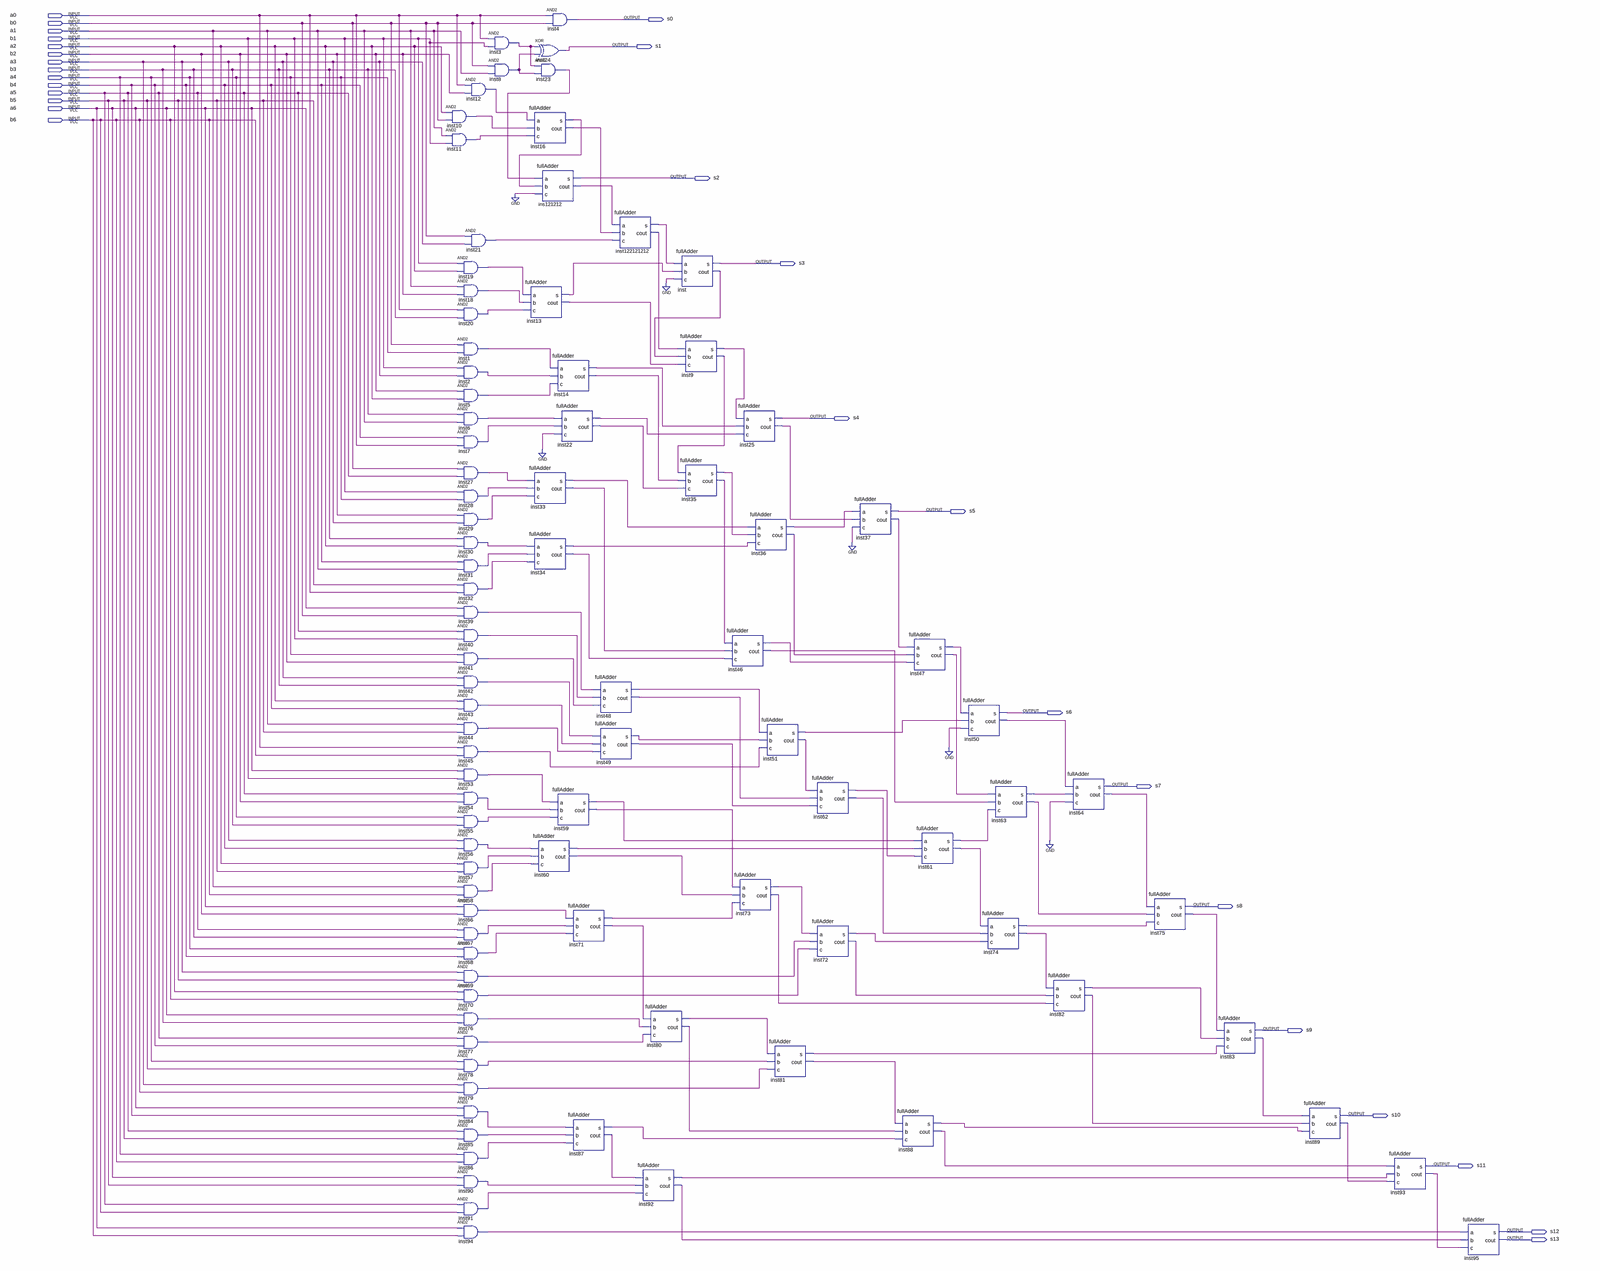
[diagram p0: schematic sheet, whole]
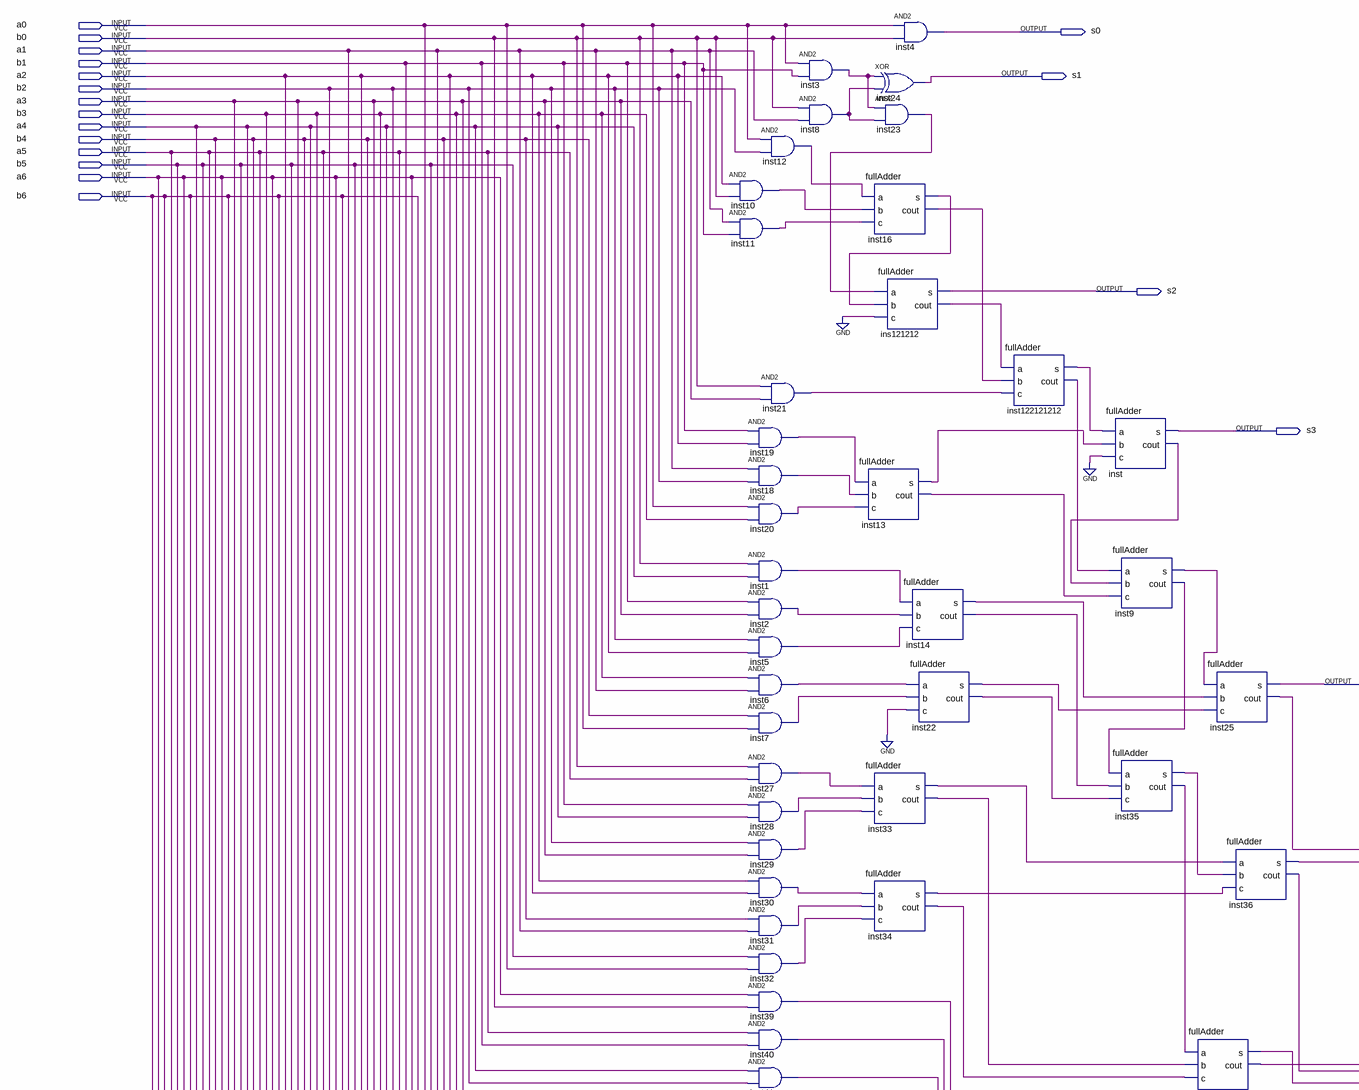
[diagram p1: schematic sheet, upper left part]
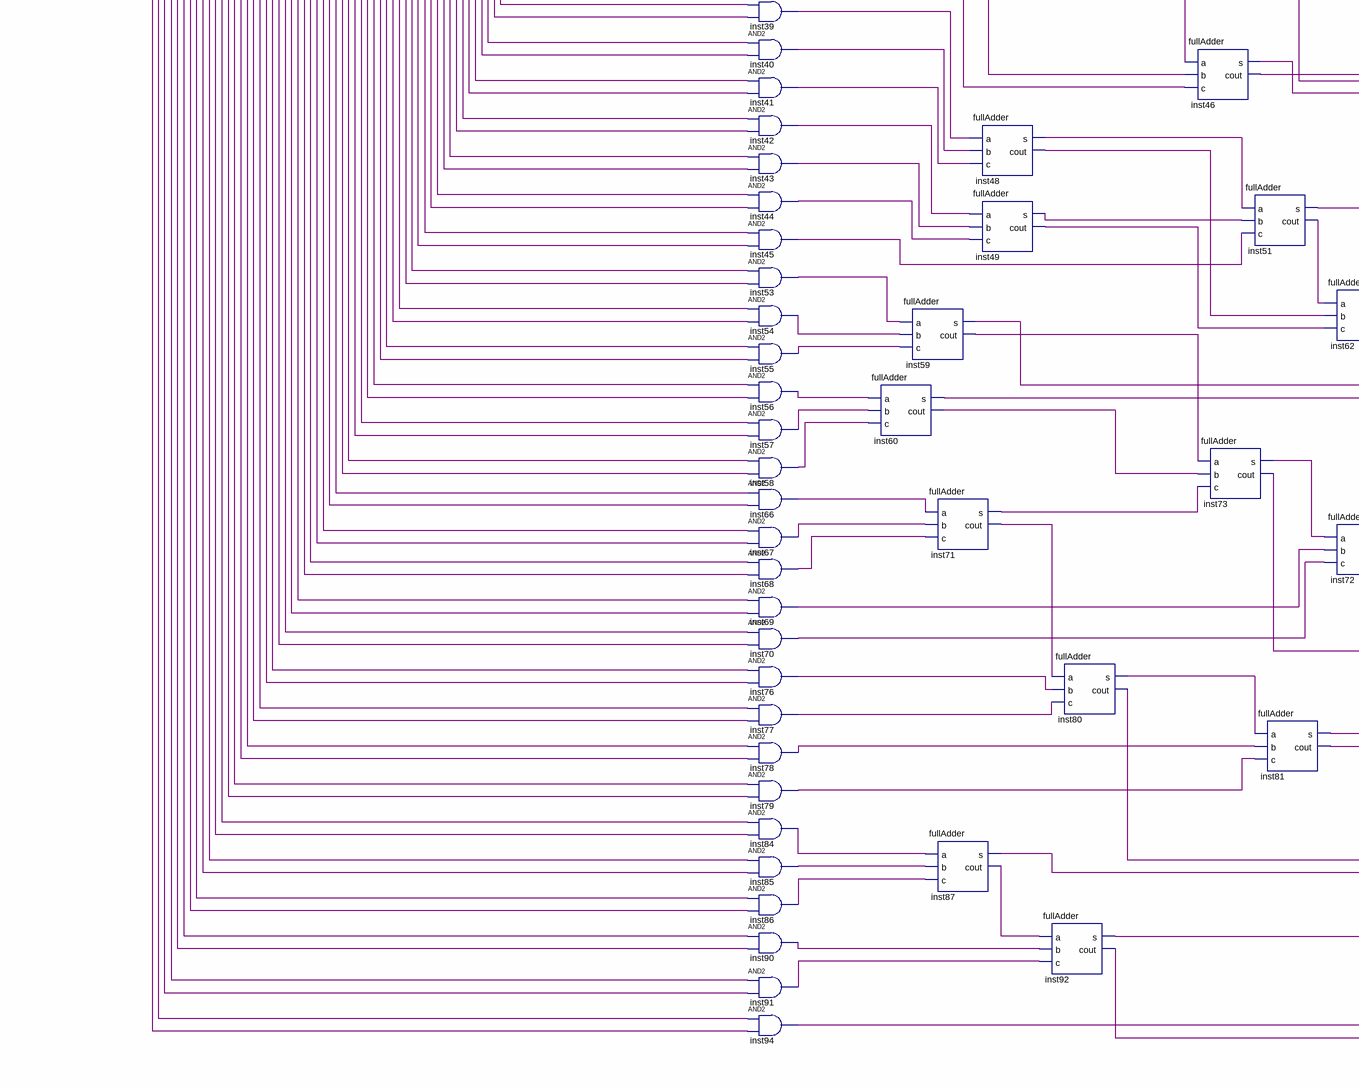
[diagram p2: schematic sheet, lower left part]
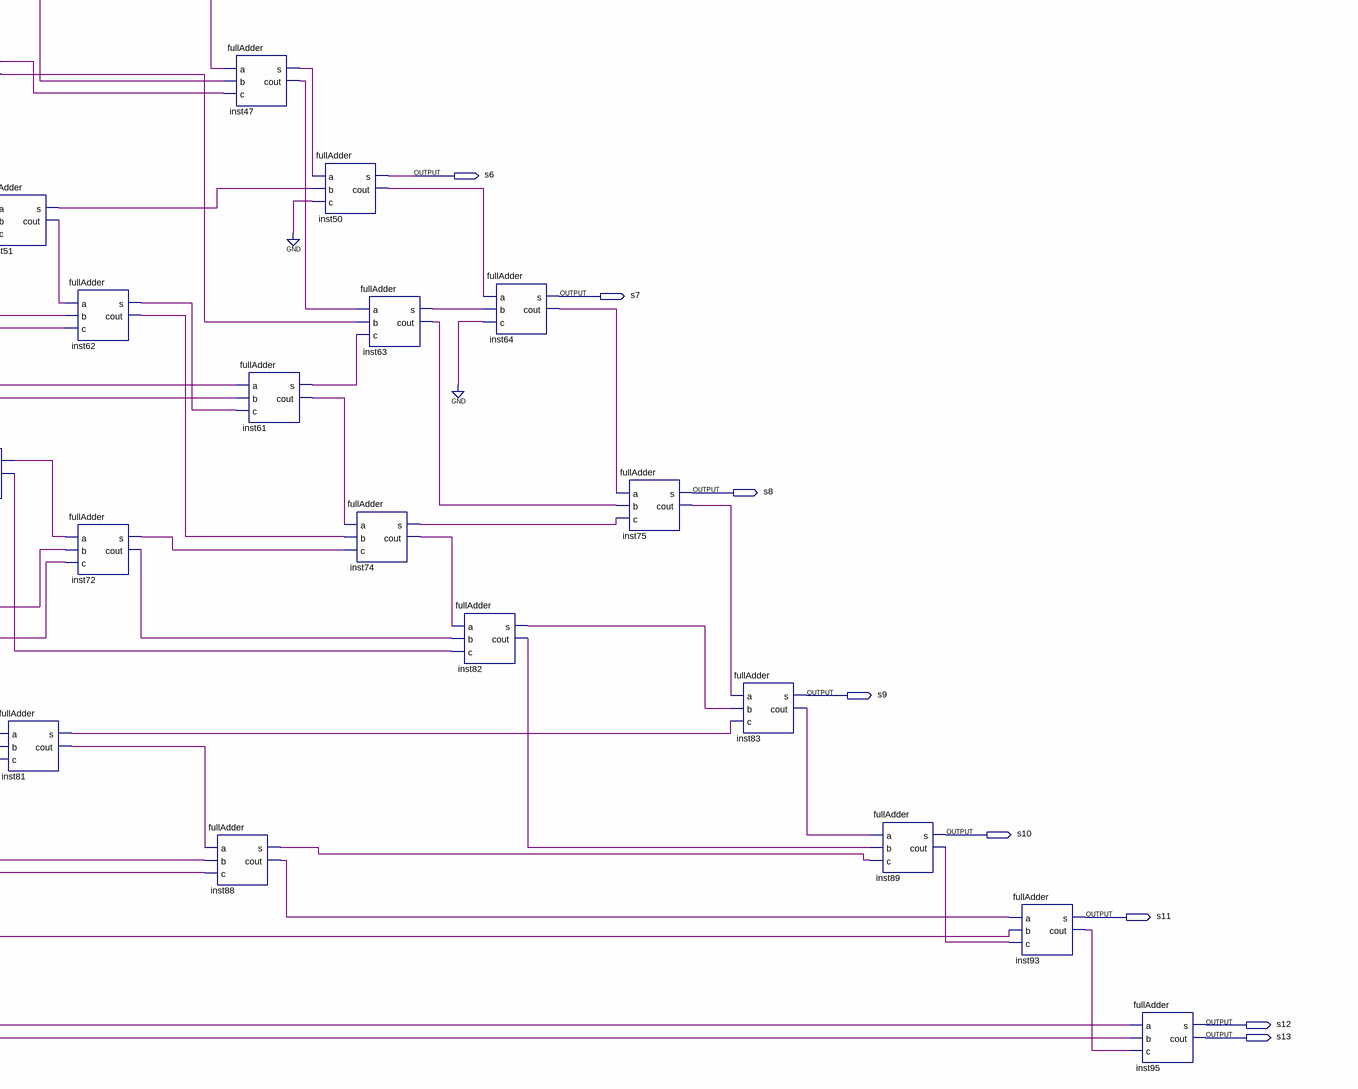
[diagram p3: schematic sheet, lower right part]
// Quartus schematic Modulo_multiplicador.bdf as structural Verilog: 92 symbols, 28 pins
module Modulo_multiplicador (
  input  a0,
  input  b0,
  input  a1,
  input  b1,
  input  a2,
  input  b2,
  input  a3,
  input  b3,
  input  a4,
  input  b4,
  input  a5,
  input  b5,
  input  a6,
  input  b6,
  output s0,
  output s1,
  output s2,
  output s3,
  output s4,
  output s5,
  output s6,
  output s7,
  output s8,
  output s9,
  output s10,
  output s11,
  output s12,
  output s13
);

  wire ins121212_cout, inst1_out, inst2_out, inst3_out, inst5_out, inst6_out, inst7_out, inst8_out,
       inst9_cout, inst9_s, inst10_out, inst11_out, inst12_out, inst13_cout, inst13_s, inst14_cout, inst14_s,
       inst16_cout, inst16_s, inst18_out, inst19_out, inst20_out, inst21_out, inst22_cout, inst22_s,
       inst23_out, inst25_cout, inst27_out, inst28_out, inst29_out, inst30_out, inst31_out, inst32_out,
       inst33_cout, inst33_s, inst34_cout, inst34_s, inst35_cout, inst35_s, inst36_cout, inst36_s,
       inst37_cout, inst39_out, inst40_out, inst41_out, inst42_out, inst43_out, inst44_out, inst45_out,
       inst46_cout, inst46_s, inst47_cout, inst47_s, inst48_cout, inst48_s, inst49_cout, inst49_s,
       inst50_cout, inst51_cout, inst51_s, inst53_out, inst54_out, inst55_out, inst56_out, inst57_out,
       inst58_out, inst59_cout, inst59_s, inst60_cout, inst60_s, inst61_cout, inst61_s, inst62_cout,
       inst62_s, inst63_cout, inst63_s, inst64_cout, inst66_out, inst67_out, inst68_out, inst69_out,
       inst70_out, inst71_cout, inst71_s, inst72_cout, inst72_s, inst73_cout, inst73_s, inst74_cout,
       inst74_s, inst75_cout, inst76_out, inst77_out, inst78_out, inst79_out, inst80_cout, inst80_s,
       inst81_cout, inst81_s, inst82_cout, inst82_s, inst83_cout, inst84_out, inst85_out, inst86_out,
       inst87_cout, inst87_s, inst88_cout, inst88_s, inst89_cout, inst90_out, inst91_out, inst92_cout,
       inst92_s, inst93_cout, inst94_out, inst122121212_cout, inst122121212_s, inst_cout;

  and inst12 (inst12_out, a0, b2);
  and inst10 (inst10_out, a2, b0);
  and inst11 (inst11_out, a1, b1);
  and inst21 (inst21_out, b0, a3);
  and inst19 (inst19_out, b1, a2);
  and inst18 (inst18_out, a1, b2);
  and inst20 (inst20_out, a0, b3);
  and inst1 (inst1_out, b0, a4);
  and inst2 (inst2_out, b1, a3);
  and inst5 (inst5_out, b2, a2);
  and inst6 (inst6_out, b3, a1);
  and inst7 (inst7_out, b4, a0);
  and inst27 (inst27_out, b0, a5);
  and inst28 (inst28_out, b1, a4);
  and inst29 (inst29_out, b2, a3);
  and inst30 (inst30_out, b3, a2);
  and inst31 (inst31_out, b4, a1);
  and inst32 (inst32_out, b5, a0);
  and inst39 (inst39_out, a6, b0);
  and inst40 (inst40_out, a5, b1);
  and inst41 (inst41_out, a4, b2);
  and inst42 (inst42_out, a3, b3);
  and inst43 (inst43_out, a2, b4);
  and inst44 (inst44_out, a1, b5);
  and inst45 (inst45_out, a0, b6);
  and inst53 (inst53_out, a6, b1);
  and inst54 (inst54_out, a5, b2);
  and inst55 (inst55_out, a4, b3);
  and inst56 (inst56_out, a3, b4);
  and inst57 (inst57_out, a2, b5);
  and inst58 (inst58_out, a1, b6);
  and inst66 (inst66_out, a6, b2);
  and inst67 (inst67_out, a5, b3);
  and inst68 (inst68_out, a4, b4);
  and inst69 (inst69_out, a3, b5);
  and inst70 (inst70_out, a2, b6);
  and inst76 (inst76_out, a6, b3);
  and inst77 (inst77_out, a5, b4);
  and inst78 (inst78_out, a4, b5);
  and inst79 (inst79_out, a3, b6);
  and inst84 (inst84_out, a6, b4);
  and inst85 (inst85_out, a5, b5);
  and inst86 (inst86_out, a4, b6);
  and inst90 (inst90_out, a6, b5);
  and inst91 (inst91_out, a5, b6);
  and inst94 (inst94_out, a6, b6);
  and inst3 (inst3_out, a0, b1);
  and inst8 (inst8_out, b0, a1);
  xor inst24 (s1, inst3_out, inst8_out);
  and inst23 (inst23_out, inst3_out, inst8_out);
  fullAdder inst16 (.a(inst12_out), .b(inst10_out), .c(inst11_out), .s(inst16_s), .cout(inst16_cout));
  fullAdder ins121212 (.a(inst23_out), .b(inst16_s), .c(1'b0), .s(s2), .cout(ins121212_cout));
  fullAdder inst13 (.a(inst19_out), .b(inst18_out), .c(inst20_out), .s(inst13_s), .cout(inst13_cout));
  fullAdder inst33 (.a(inst27_out), .b(inst28_out), .c(inst29_out), .s(inst33_s), .cout(inst33_cout));
  fullAdder inst34 (.a(inst30_out), .b(inst31_out), .c(inst32_out), .s(inst34_s), .cout(inst34_cout));
  fullAdder inst60 (.a(inst56_out), .b(inst57_out), .c(inst58_out), .s(inst60_s), .cout(inst60_cout));
  and inst4 (s0, a0, b0);
  fullAdder inst14 (.a(inst1_out), .b(inst2_out), .c(inst5_out), .s(inst14_s), .cout(inst14_cout));
  fullAdder inst22 (.a(inst6_out), .b(inst7_out), .c(1'b0), .s(inst22_s), .cout(inst22_cout));
  fullAdder inst59 (.a(inst53_out), .b(inst54_out), .c(inst55_out), .s(inst59_s), .cout(inst59_cout));
  fullAdder inst71 (.a(inst66_out), .b(inst67_out), .c(inst68_out), .s(inst71_s), .cout(inst71_cout));
  fullAdder inst87 (.a(inst84_out), .b(inst85_out), .c(inst86_out), .s(inst87_s), .cout(inst87_cout));
  fullAdder inst48 (.a(inst39_out), .b(inst40_out), .c(inst41_out), .s(inst48_s), .cout(inst48_cout));
  fullAdder inst49 (.a(inst42_out), .b(inst43_out), .c(inst44_out), .s(inst49_s), .cout(inst49_cout));
  fullAdder inst122121212 (
    .a(ins121212_cout), .b(inst16_cout), .c(inst21_out), .s(inst122121212_s), .cout(inst122121212_cout));
  fullAdder inst80 (.a(inst71_cout), .b(inst76_out), .c(inst77_out), .s(inst80_s), .cout(inst80_cout));
  fullAdder inst92 (.a(inst87_cout), .b(inst90_out), .c(inst91_out), .s(inst92_s), .cout(inst92_cout));
  fullAdder inst (.a(inst122121212_s), .b(inst13_s), .c(1'b0), .s(s3), .cout(inst_cout));
  fullAdder inst9 (.a(inst122121212_cout), .b(inst_cout), .c(inst13_cout), .s(inst9_s), .cout(inst9_cout));
  fullAdder inst35 (.a(inst9_cout), .b(inst14_cout), .c(inst22_cout), .s(inst35_s), .cout(inst35_cout));
  fullAdder inst25 (.a(inst9_s), .b(inst14_s), .c(inst22_s), .s(s4), .cout(inst25_cout));
  fullAdder inst36 (.a(inst33_s), .b(inst35_s), .c(inst34_s), .s(inst36_s), .cout(inst36_cout));
  fullAdder inst46 (.a(inst35_cout), .b(inst33_cout), .c(inst34_cout), .s(inst46_s), .cout(inst46_cout));
  fullAdder inst73 (.a(inst59_cout), .b(inst60_cout), .c(inst71_s), .s(inst73_s), .cout(inst73_cout));
  fullAdder inst51 (.a(inst48_s), .b(inst49_s), .c(inst45_out), .s(inst51_s), .cout(inst51_cout));
  fullAdder inst81 (.a(inst80_s), .b(inst78_out), .c(inst79_out), .s(inst81_s), .cout(inst81_cout));
  fullAdder inst62 (.a(inst51_cout), .b(inst48_cout), .c(inst49_cout), .s(inst62_s), .cout(inst62_cout));
  fullAdder inst72 (.a(inst73_s), .b(inst69_out), .c(inst70_out), .s(inst72_s), .cout(inst72_cout));
  fullAdder inst37 (.a(inst36_s), .b(inst25_cout), .c(1'b0), .s(s5), .cout(inst37_cout));
  fullAdder inst47 (.a(inst37_cout), .b(inst36_cout), .c(inst46_s), .s(inst47_s), .cout(inst47_cout));
  fullAdder inst88 (.a(inst81_cout), .b(inst80_cout), .c(inst87_s), .s(inst88_s), .cout(inst88_cout));
  fullAdder inst61 (.a(inst59_s), .b(inst60_s), .c(inst62_s), .s(inst61_s), .cout(inst61_cout));
  fullAdder inst50 (.a(inst47_s), .b(inst51_s), .c(1'b0), .s(s6), .cout(inst50_cout));
  fullAdder inst63 (.a(inst47_cout), .b(inst46_cout), .c(inst61_s), .s(inst63_s), .cout(inst63_cout));
  fullAdder inst74 (.a(inst61_cout), .b(inst62_cout), .c(inst72_s), .s(inst74_s), .cout(inst74_cout));
  fullAdder inst82 (.a(inst74_cout), .b(inst72_cout), .c(inst73_cout), .s(inst82_s), .cout(inst82_cout));
  fullAdder inst64 (.a(inst50_cout), .b(inst63_s), .c(1'b0), .s(s7), .cout(inst64_cout));
  fullAdder inst75 (.a(inst64_cout), .b(inst63_cout), .c(inst74_s), .s(s8), .cout(inst75_cout));
  fullAdder inst83 (.a(inst75_cout), .b(inst82_s), .c(inst81_s), .s(s9), .cout(inst83_cout));
  fullAdder inst89 (.a(inst83_cout), .b(inst82_cout), .c(inst88_s), .s(s10), .cout(inst89_cout));
  fullAdder inst93 (.a(inst88_cout), .b(inst92_s), .c(inst89_cout), .s(s11), .cout(inst93_cout));
  fullAdder inst95 (.a(inst94_out), .b(inst92_cout), .c(inst93_cout), .s(s12), .cout(s13));
endmodule
